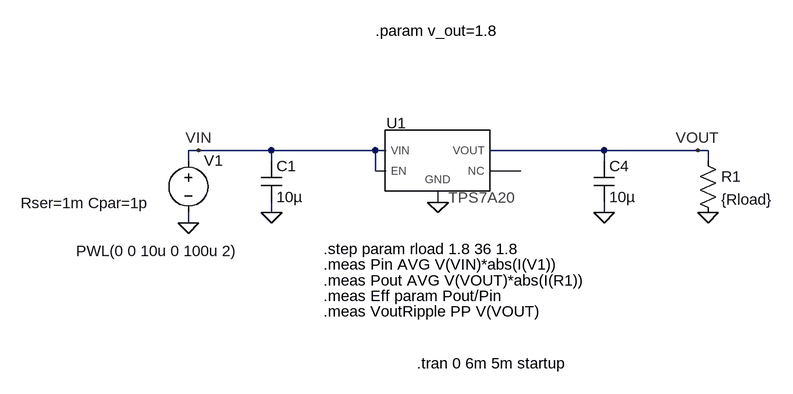
[diagram p0: schematic TPS7A20.asc]
TPS7A20.asc, the LTspice schematic file:
Version 4
SHEET 1 1092 11304
WIRE -416 10960 -432 10960
WIRE -304 10960 -416 10960
WIRE -144 10960 -304 10960
WIRE -128 10960 -144 10960
WIRE 208 10960 32 10960
WIRE 352 10960 208 10960
WIRE 368 10960 352 10960
WIRE -432 10976 -432 10960
WIRE -304 10976 -304 10960
WIRE 208 10976 208 10960
WIRE 368 10976 368 10960
WIRE -144 10992 -144 10960
WIRE -128 10992 -144 10992
WIRE 80 10992 32 10992
WIRE -48 11040 -48 11024
WIRE -304 11056 -304 11040
WIRE 208 11056 208 11040
WIRE -432 11072 -432 11056
FLAG 368 11056 0
FLAG -304 11056 0
FLAG 208 11056 0
FLAG -48 11040 0
FLAG -432 11072 0
FLAG 352 10960 VOUT
FLAG -416 10960 VIN
SYMBOL cap -320 10976 R0
SYMATTR InstName C1
SYMATTR Value 10µ
SYMATTR SpiceLine V=35 Irms=0 Rser=0 Lser=0 mfg="Murata" pn="GRM188R6YA106MA73" type="X5R"
SYMBOL cap 192 10976 R0
SYMATTR InstName C4
SYMATTR Value 10µ
SYMATTR SpiceLine V=35 Irms=0 Rser=0 Lser=0 mfg="Murata" pn="GRM188R6YA106MA73" type="X5R"
SYMBOL voltage -432 10960 R0
WINDOW 3 -173 155 Left 2
WINDOW 123 0 0 Left 0
WINDOW 39 -258 81 Left 2
SYMATTR Value PWL(0 0 10u 0 100u 2)
SYMATTR SpiceLine Rser=1m Cpar=1p
SYMATTR InstName V1
SYMBOL TPS7A20 -48 10976 R0
SYMATTR InstName U1
SYMBOL res 352 10960 R0
SYMATTR InstName R1
SYMATTR Value {Rload}
TEXT -80 11288 Left 2 !.tran 0 6m 5m startup
TEXT -144 10776 Left 2 !.param v_out=1.8
TEXT -224 11136 Left 2 !.meas Pin AVG V(VIN)*abs(I(V1))
TEXT -224 11160 Left 2 !.meas Pout AVG V(VOUT)*abs(I(R1))
TEXT -224 11112 Left 2 !.step param rload 1.8 36 1.8
TEXT -224 11184 Left 2 !.meas Eff param Pout/Pin
TEXT -224 11208 Left 2 !.meas VoutRipple PP V(VOUT)

The netlist it stands for:
* TPS7A20.asc
C1 VIN 0 10µ V=35 Irms=0 Rser=0 Lser=0 mfg="Murata" pn="GRM188R6YA106MA73" type="X5R"
C4 VOUT 0 10µ V=35 Irms=0 Rser=0 Lser=0 mfg="Murata" pn="GRM188R6YA106MA73" type="X5R"
V1 VIN 0 PWL(0 0 10u 0 100u 2) Rser=1m Cpar=1p
XU1 VIN 0 VIN N001 VOUT TPS7A20_ADJ_TRANS  ; pins VIN GND EN NC VOUT
R1 VOUT 0 {Rload}
.tran 0 6m 5m startup
.param v_out=1.8
.meas Pin AVG V(VIN)*abs(I(V1))
.meas Pout AVG V(VOUT)*abs(I(R1))
.step param rload 1.8 36 1.8
.meas Eff param Pout/Pin
.meas VoutRipple PP V(VOUT)
.lib tps7a20-adj_trans.lib
.backanno
.end